# Altium schematic sheet #NIP涡轮驱动板-TMC.SchDoc
size A3
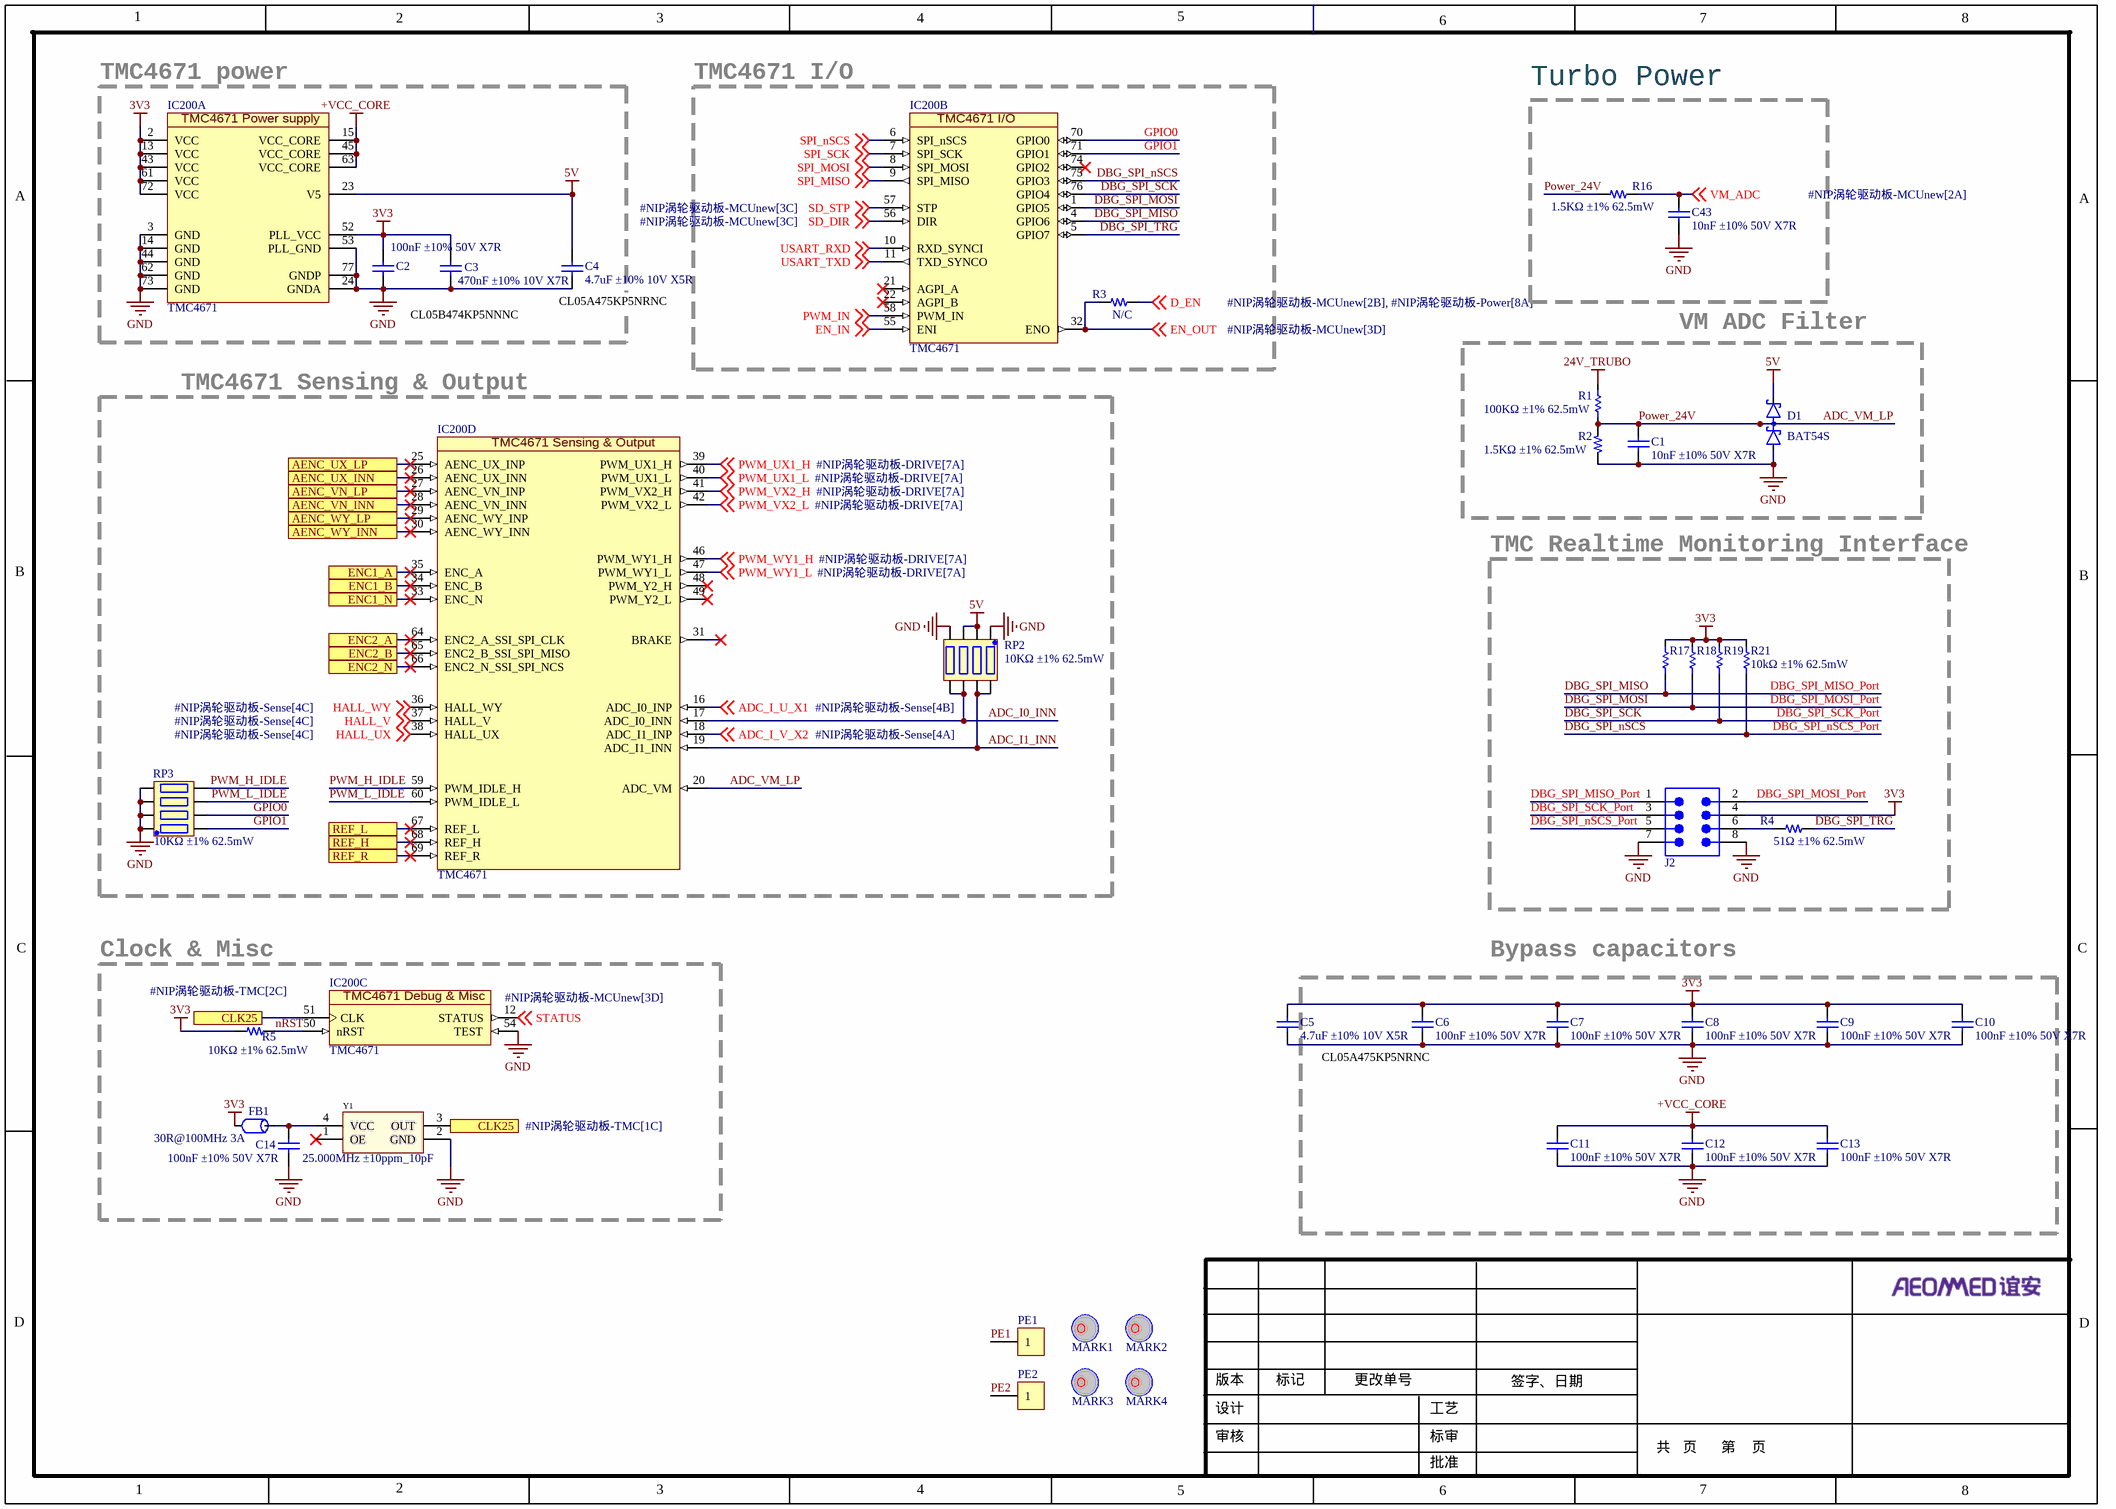
[diagram p0: #NIP涡轮驱动板-TMC.SchDoc]

## Parts
C1  10nF ±10% 50V X7R  [C0402]
C2  100nF ±10% 50V X7R  [C0402]
C3  470nF ±10% 10V X7R  [C0402]
C4  4.7uF ±10% 10V X5R  [C0402]
C5  4.7uF ±10% 10V X5R  [C0402]
C6  100nF ±10% 50V X7R  [C0402]
C7  100nF ±10% 50V X7R  [C0402]
C8  100nF ±10% 50V X7R  [C0402]
C9  100nF ±10% 50V X7R  [C0402]
C10  100nF ±10% 50V X7R  [C0402]
C11  100nF ±10% 50V X7R  [C0402]
C12  100nF ±10% 50V X7R  [C0402]
C13  100nF ±10% 50V X7R  [C0402]
C14  100nF ±10% 50V X7R  [C0402]
C43  10nF ±10% 50V X7R  [C0402]
D1  BAT54S  [SOT23-3]
FB1  30R@100MHz 3A  [FB-0603]
IC200  TMC4671  [QFN40P1050X650X90_HS-77N]  (parts A,B,C,D of 5)
J2  62000821121  [62000821121]  (value not drawn)
MARK1  MARK_POINT  [MARK_POINT]  (value not drawn)
MARK2  MARK_POINT  [MARK_POINT]  (value not drawn)
MARK3  MARK_POINT  [MARK_POINT]  (value not drawn)
MARK4  MARK_POINT  [MARK_POINT]  (value not drawn)
PE1  (no value)  [固定孔-M3]
PE2  (no value)  [固定孔-M3]
R1  100KΩ ±1% 62.5mW  [R0402]
R2  1.5KΩ ±1% 62.5mW  [R0402]
R3  N/C  [R0402]
R4  51Ω ±1% 62.5mW  [R0402]
R5  10KΩ ±1% 62.5mW  [R0402]
R16  1.5KΩ ±1% 62.5mW  [R0402]
R17  10kΩ ±1% 62.5mW  [R0402]  (value not drawn)
R18  10kΩ ±1% 62.5mW  [R0402]  (value not drawn)
R19  10kΩ ±1% 62.5mW  [R0402]  (value not drawn)
R21  10kΩ ±1% 62.5mW  [R0402]
RP2  10KΩ ±1% 62.5mW  [RES-ARRAY-SMD_0402-8P-L2.0-W1.0-BL]
RP3  10KΩ ±1% 62.5mW  [RES-ARRAY-SMD_0402-8P-L2.0-W1.0-BL]
Y1  25.000MHz ±10ppm_10pF  [OSC-SMD_4P-L2.5-W2.0-BL-1]

## Blocks framed on the sheet
TMC4671 power: C2-C4 IC200
TMC4671 I/O: IC200 R3
Turbo Power: C43 R16
VM ADC Filter: C1 D1 R1 R2
TMC4671 Sensing & Output: IC200 RP2 RP3
TMC Realtime Monitoring Interface: J2 R4 R17-R19 R21
Clock & Misc: C14 FB1 IC200 R5 Y1
Bypass capacitors: C6-C13

## Ports
AENC_UX_INN, AENC_UX_LP, AENC_VN_INN, AENC_VN_LP, AENC_WY_INN, AENC_WY_LP, CLK25 (see #NIP涡轮驱动板-TMC[1C]), CLK25 (see #NIP涡轮驱动板-TMC[2C]), ENC1_A, ENC1_B, ENC1_N, ENC2_A, ENC2_B, ENC2_N, REF_H, REF_L, REF_R

## Nets
3V3: C2.2 C3.2 C5.2 C6.2 C7.2 C8.2 C9.2 C10.2 FB1.2 IC200.2(VCC) IC200.13(VCC) IC200.43(VCC) IC200.52(PLL_VCC) IC200.61(VCC) IC200.72(VCC) J2.4 R5.1 R17.2 R18.2 R19.2 R21.2
5V: C4.2 D1.2(C2) IC200.23(V5) RP2.2 RP2.3
24V_TRUBO: R1.2
+VCC_CORE: C11.2 C12.2 C13.2 IC200.15(VCC_CORE) IC200.45(VCC_CORE) IC200.63(VCC_CORE)
GND: C1.1 C2.1 C3.1 C4.1 C5.1 C6.1 C7.1 C8.1 C9.1 C10.1 C11.1 C12.1 C13.1 C14.1 C43.1 D1.1(A1) IC200.3(GND) IC200.14(GND) IC200.24(GNDA) IC200.44(GND) IC200.53(PLL_GND) IC200.54(TEST) IC200.62(GND) IC200.73(GND) IC200.77(GNDP) J2.7 J2.8 R2.1 RP2.1 RP2.4 RP3.1 RP3.2 RP3.3 RP3.4 Y1.2(GND)
ADC_I0_INN: IC200.17(ADC_I0_INN) RP2.5 RP2.6
ADC_I1_INN: IC200.19(ADC_I1_INN) RP2.7 RP2.8
ADC_I_U_X1: IC200.16(ADC_I0_INP) ; off-sheet ADC_I_U_X1
ADC_I_V_X2: IC200.18(ADC_I1_INP) ; off-sheet ADC_I_V_X2
ADC_VM_LP: C1.2 D1.3(C1A2) IC200.20(ADC_VM) R1.1 R2.2 R16.1  [also labelled Power_24V]
AENC_UX_INN: IC200.26(AENC_UX_INN) ; port AENC_UX_INN
AENC_UX_LP: IC200.25(AENC_UX_INP) ; port AENC_UX_LP
AENC_VN_INN: IC200.28(AENC_VN_INN) ; port AENC_VN_INN
AENC_VN_LP: IC200.27(AENC_VN_INP) ; port AENC_VN_LP
AENC_WY_INN: IC200.30(AENC_WY_INN) ; port AENC_WY_INN
AENC_WY_LP: IC200.29(AENC_WY_INP) ; port AENC_WY_LP
CLK25: IC200.51(CLK) Y1.3(OUT) ; port CLK25
D_EN: R3.2 ; off-sheet D_EN
DBG_SPI_MISO: IC200.4(GPIO6) J2.1 R17.1  [also labelled DBG_SPI_MISO_Port]
DBG_SPI_MOSI: IC200.1(GPIO5) J2.2 R18.1  [also labelled DBG_SPI_MOSI_Port]
DBG_SPI_nSCS: IC200.75(GPIO3) J2.5 R21.1  [also labelled DBG_SPI_nSCS_Port]
DBG_SPI_SCK: IC200.76(GPIO4) J2.3 R19.1  [also labelled DBG_SPI_SCK_Port]
DBG_SPI_TRG: IC200.5(GPIO7) R4.2
EN_IN: IC200.55(ENI) ; off-sheet EN_IN
EN_OUT: IC200.32(ENO) R3.1 ; off-sheet EN_OUT
ENC1_A: IC200.35(ENC_A) ; port ENC1_A
ENC1_B: IC200.34(ENC_B) ; port ENC1_B
ENC1_N: IC200.33(ENC_N) ; port ENC1_N
ENC2_A: IC200.64(ENC2_A_SSI_SPI_CLK) ; port ENC2_A
ENC2_B: IC200.65(ENC2_B_SSI_SPI_MISO) ; port ENC2_B
ENC2_N: IC200.66(ENC2_N_SSI_SPI_NCS) ; port ENC2_N
GPIO0: IC200.70(GPIO0) RP3.7
GPIO1: IC200.71(GPIO1) RP3.8
HALL_UX: IC200.38(HALL_UX) ; off-sheet HALL_UX
HALL_V: IC200.37(HALL_V) ; off-sheet HALL_V
HALL_WY: IC200.36(HALL_WY) ; off-sheet HALL_WY
nRST: IC200.50(nRST) R5.2
PE1: PE1.1
PE2: PE2.1
PWM_H_IDLE: IC200.59(PWM_IDLE_H) RP3.5
PWM_IN: IC200.58(PWM_IN) ; off-sheet PWM_IN
PWM_L_IDLE: IC200.60(PWM_IDLE_L) RP3.6
PWM_UX1_H: IC200.39(PWM_UX1_H) ; off-sheet PWM_UX1_H
PWM_UX1_L: IC200.40(PWM_UX1_L) ; off-sheet PWM_UX1_L
PWM_VX2_H: IC200.41(PWM_VX2_H) ; off-sheet PWM_VX2_H
PWM_VX2_L: IC200.42(PWM_VX2_L) ; off-sheet PWM_VX2_L
PWM_WY1_H: IC200.46(PWM_WY1_H) ; off-sheet PWM_WY1_H
PWM_WY1_L: IC200.47(PWM_WY1_L) ; off-sheet PWM_WY1_L
REF_H: IC200.68(REF_H) ; port REF_H
REF_L: IC200.67(REF_L) ; port REF_L
REF_R: IC200.69(REF_R) ; port REF_R
SD_DIR: IC200.56(DIR) ; off-sheet SD_DIR
SD_STP: IC200.57(STP) ; off-sheet SD_STP
SPI_MISO: IC200.9(SPI_MISO) ; off-sheet SPI_MISO
SPI_MOSI: IC200.8(SPI_MOSI) ; off-sheet SPI_MOSI
SPI_nSCS: IC200.6(SPI_nSCS) ; off-sheet SPI_nSCS
SPI_SCK: IC200.7(SPI_SCK) ; off-sheet SPI_SCK
STATUS: IC200.12(STATUS) ; off-sheet STATUS
USART_RXD: IC200.10(RXD_SYNCI) ; off-sheet USART_RXD
USART_TXD: IC200.11(TXD_SYNCO) ; off-sheet USART_TXD
VM_ADC: C43.2 R16.2 ; off-sheet VM_ADC
NetC14_2: C14.2 FB1.1 Y1.4(VCC)
NetJ2_6: J2.6 R4.1

Not connected (* = marked no-connect by the designer): IC200 21(AGPI_A)* 22(AGPI_B)* 31(BRAKE)* 48(PWM_Y2_H)* 49(PWM_Y2_L)* 74(GPIO2)*; Y1 1(OE)*

## Notes on the sheet
- CL05B474KP5NNNC
- (near C4) CL05A475KP5NRNC
- (near C6) CL05A475KP5NRNC
- 1
- 2
- 3
- 4
- 5
- 6
- 7
- 8
- A
- B
- C
- D
- 版本
- 标记
- 更改单号
- 签字、日期
- 设计
- 审核
- 工艺
- 标审
- 共   页      第    页
- 批准
- (in symbol TMC4671, part A) TMC4671 Power supply
- (in symbol TMC4671, part B) TMC4671 I/O
- (in symbol TMC4671, part C) TMC4671 Debug & Misc
- (in symbol TMC4671, part D) TMC4671 Sensing & Output

## Library data of the parts
C1 C43 = C-0603: CL05B103KB5NNNC; 物料编号: *; 物料名称: *; 厂家: *; 详细描述: *
C2 C6-C14 = Cap: Capacitor; Published: 8-Jun-2000; LatestRevisionDate: 17-Jul-2002; LatestRevisionNote: Re-released for DXP Platform.; PackageReference: RAD-0.3; Publisher: Altium Limited; PackageDescription: Radial Cap, Thru-Hole; 2 Leads; 0.3 in Pin Spacing
C3 = Cap: CL05B474KP5NNNC; Published: 8-Jun-2000; LatestRevisionDate: 17-Jul-2002; LatestRevisionNote: Re-released for DXP Platform.; PackageReference: RAD-0.3; Publisher: Altium Limited; PackageDescription: Radial Cap, Thru-Hole; 2 Leads; 0.3 in Pin Spacing
C4 C5 = Cap: CL05A475KP5NRNC; Published: 8-Jun-2000; LatestRevisionDate: 17-Jul-2002; LatestRevisionNote: Re-released for DXP Platform.; PackageReference: RAD-0.3; Publisher: Altium Limited; PackageDescription: Radial Cap, Thru-Hole; 2 Leads; 0.3 in Pin Spacing
D1 = BAT54S: 品牌：NXP，型号：BAT54S，0.11A,30V，ROHS; MF: NXP; MPN: BAT54S
FB1 = FB-0603: 品牌：TDK，型号：MPZ1608S601A , 600 ohm@100MHz ，1 A，25%，ROHS
IC200 = TMC4671: 品牌：TRINAMIC，型号：TMC4671，ROHS; MPN: TMC4671; MF: TRINAMIC
J2 = 62000821121: WR-PHD Pin Header, THT, Vertical, pitch 2mm, 2 Row, 8P; Manufacturer: Wurth Elektronik; Contact Resistance: 20mOhm; Rated Current: 2A; Working Voltage: 200V; Withstanding Voltage: 500V; Manufacturer Part Number: 62000821121; Category: Board-to-Board Connectors; Match Code: WR-PHD; ComponentLink1Description: Website Link; ComponentLink1URL: https://www.we-online.com/redexpert/article/62000821121?ad; ComponentLink2Description: Datasheet Link; ComponentLink2URL: https://www.we-online.com/redexpert/spec/62000821121?ad; Mount: Through Hole; Operating Temperature Max: 105°C; Operating Temperature Min: -40°C; Packaging: Bag; Gender: Pin Header; Number of Pins: 8; Number of Rows: 2; Orientation: Vertical; Pitch: 2mm
PE1 PE2 = CON1: Connector
R1 = Res_0402: RC0402FR-07100KL; Published: 8-Jun-2000; LatestRevisionDate: 17-Jul-2002; LatestRevisionNote: Re-released for DXP Platform.; PackageReference: AXIAL-0.3; Publisher: Altium Limited; PackageDescription: Axial Device, Thru-Hole; 2 Leads; 0.3 in Pin Spacing
R2-R5 R16 = R-0603
R17-R19 R21 = Res_0402: Resistor; Published: 8-Jun-2000; LatestRevisionDate: 17-Jul-2002; LatestRevisionNote: Re-released for DXP Platform.; PackageReference: AXIAL-0.3; Publisher: Altium Limited; PackageDescription: Axial Device, Thru-Hole; 2 Leads; 0.3 in Pin Spacing
RP2 RP3 = RP-0603
Y1 = oscillator: YSO110TR 25MHZ 1.8V-3.3V ±10PPM -40~85℃（±20PPM) CMOS OT3JI-111-25M; Manufacturer: EPSON(爱普生); Name: 100MHz; Symbol: SG-8101CE-100.000000MHZ-TCHPA; Device: SG-8101CE 100.000000MHz TCHPA; Add into BOM: yes; Value: 100MHz; Frequency Stability: ±20ppm; Supply Voltage: 1.8V~3.3V; LCSC Part Name: 3225 100MHz 1.8~3.3V 20ppm  OE  SMD_4P -40~+105℃; Supplier Part: C390559; Manufacturer Part: SG-8101CE 100.000000MHz TCHPA; Supplier Footprint: SMD3225-4P; JLCPCB Part Class: Extended Part; Datasheet: https://atta.szlcsc.com/upload/public/pdf/source/20190626/C390559_D0305530A2A3721045533DB4F9788766.pdf; Supplier: LCSC; Convert to PCB: yes; Operating Temperature: -40℃~+105℃